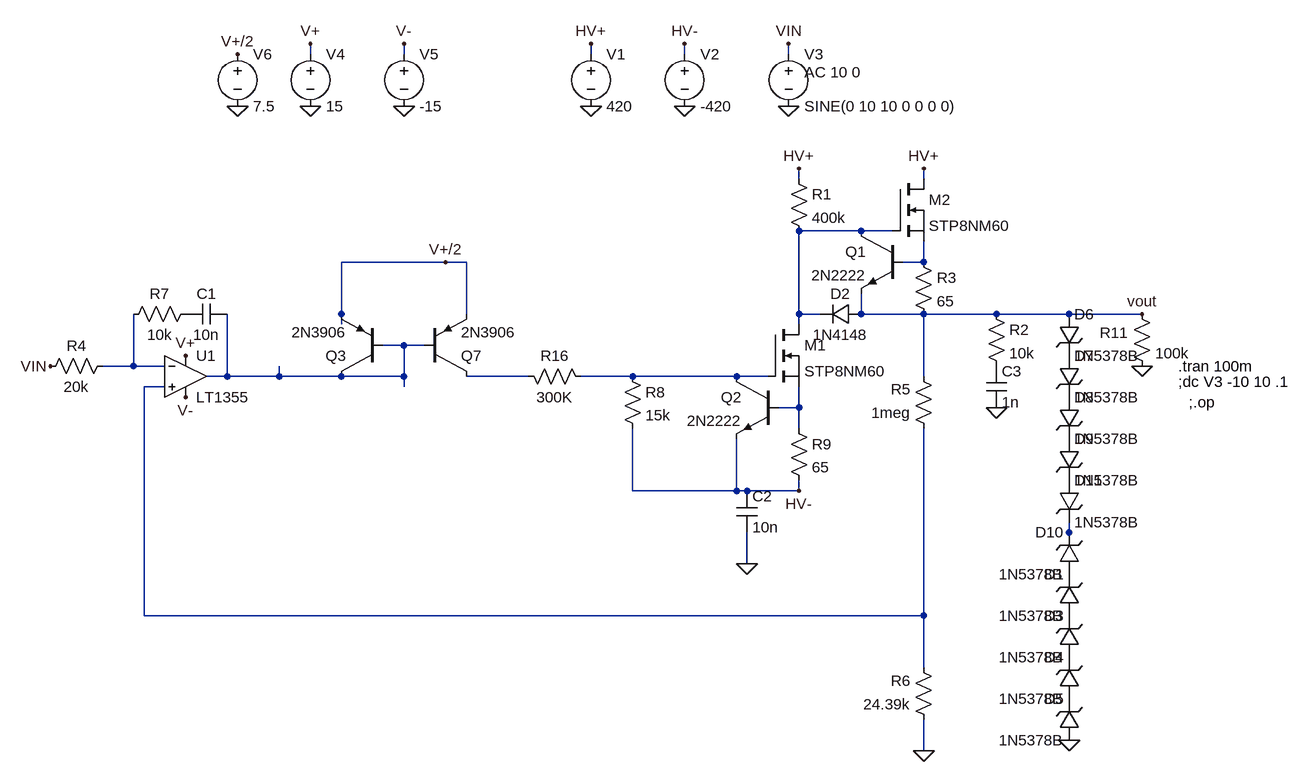
[diagram p0: schematic Draft11b.asc]
Draft11b.asc, the LTspice schematic file:
Version 4
SHEET 1 992 932
WIRE -544 -208 -544 -224
WIRE -400 -208 -400 -224
WIRE -112 -208 -112 -224
WIRE 32 -208 32 -224
WIRE 192 -208 192 -224
WIRE 208 -16 208 -32
WIRE 400 -16 400 -32
WIRE 304 64 208 64
WIRE 352 64 304 64
WIRE -336 112 -496 112
WIRE -304 112 -336 112
WIRE 400 112 400 80
WIRE 400 112 368 112
WIRE -496 192 -496 112
WIRE -304 192 -304 112
WIRE 208 192 208 64
WIRE 240 192 208 192
WIRE 304 192 304 160
WIRE 400 192 304 192
WIRE 512 192 400 192
WIRE 624 192 512 192
WIRE 736 192 624 192
WIRE -496 208 -496 192
WIRE 208 208 208 192
WIRE -400 240 -432 240
WIRE -368 240 -400 240
WIRE -816 272 -816 192
WIRE -816 272 -864 272
WIRE -768 272 -816 272
WIRE -672 288 -672 192
WIRE -672 288 -704 288
WIRE -592 288 -592 272
WIRE -592 288 -672 288
WIRE -496 288 -592 288
WIRE -400 288 -400 240
WIRE -400 288 -496 288
WIRE -208 288 -304 288
WIRE -48 288 -128 288
WIRE 112 288 -48 288
WIRE 160 288 112 288
WIRE 400 288 400 192
WIRE -768 304 -800 304
WIRE -400 304 -400 288
WIRE 208 336 208 304
WIRE 208 336 176 336
WIRE 208 368 208 336
WIRE -48 464 -48 368
WIRE 112 464 112 384
WIRE 112 464 -48 464
WIRE 128 464 112 464
WIRE 208 464 208 448
WIRE 208 464 128 464
WIRE 624 528 624 512
WIRE 624 544 624 528
WIRE 128 576 128 528
WIRE -800 656 -800 304
WIRE 400 656 400 368
WIRE 400 656 -800 656
WIRE 400 736 400 656
WIRE 400 864 400 816
FLAG -112 -128 0
FLAG 32 -128 0
FLAG 192 -128 0
FLAG -112 -224 HV+
FLAG 32 -224 HV-
FLAG 192 -224 VIN
FLAG 208 -32 HV+
FLAG 400 -32 HV+
FLAG -544 -128 0
FLAG -400 -128 0
FLAG -544 -224 V+
FLAG -400 -224 V-
FLAG -736 256 V+
FLAG -736 320 V-
FLAG -944 272 VIN
FLAG 400 864 0
FLAG 128 576 0
FLAG 208 464 HV-
FLAG 512 336 0
FLAG 736 192 vout
FLAG 736 272 0
FLAG 624 848 0
FLAG -656 -128 0
FLAG -656 -208 V+/2
FLAG -336 112 V+/2
SYMBOL nmos 160 208 R0
SYMATTR InstName M1
SYMATTR Value STP8NM60
SYMBOL voltage -112 -224 R0
WINDOW 123 0 0 Left 2
WINDOW 39 0 0 Left 2
SYMATTR InstName V1
SYMATTR Value 420
SYMBOL voltage 32 -224 R0
WINDOW 123 0 0 Left 2
WINDOW 39 0 0 Left 2
SYMATTR InstName V2
SYMATTR Value -420
SYMBOL voltage 192 -224 R0
WINDOW 123 24 44 Left 2
WINDOW 39 0 0 Left 2
SYMATTR Value2 AC 10 0
SYMATTR InstName V3
SYMATTR Value SINE(0 10 10 0 0 0 0)
SYMBOL nmos 352 -16 R0
SYMATTR InstName M2
SYMATTR Value STP8NM60
SYMBOL diode 304 176 R90
WINDOW 0 0 32 VBottom 2
WINDOW 3 32 32 VTop 2
SYMATTR InstName D2
SYMATTR Value 1N4148
SYMBOL npn 368 64 M0
SYMATTR InstName Q1
SYMATTR Value 2N2222
SYMBOL res 384 96 R0
SYMATTR InstName R3
SYMATTR Value 65
SYMBOL voltage -544 -224 R0
WINDOW 123 0 0 Left 2
WINDOW 39 0 0 Left 2
SYMATTR InstName V4
SYMATTR Value 15
SYMBOL voltage -400 -224 R0
WINDOW 123 0 0 Left 2
WINDOW 39 0 0 Left 2
SYMATTR InstName V5
SYMATTR Value -15
SYMBOL Opamps\\LT1355 -736 224 R0
SYMATTR InstName U1
SYMBOL res -848 256 R90
WINDOW 0 0 56 VBottom 2
WINDOW 3 32 56 VTop 2
SYMATTR InstName R4
SYMATTR Value 20k
SYMBOL res 416 384 R180
WINDOW 0 36 76 Left 2
WINDOW 3 36 40 Left 2
SYMATTR InstName R5
SYMATTR Value 1meg
SYMBOL res 416 832 R180
WINDOW 0 36 76 Left 2
WINDOW 3 36 40 Left 2
SYMATTR InstName R6
SYMATTR Value 24.39k
SYMBOL res -720 176 R90
WINDOW 0 0 56 VBottom 2
WINDOW 3 32 56 VTop 2
SYMATTR InstName R7
SYMATTR Value 10k
SYMBOL cap -672 176 R90
WINDOW 0 0 32 VBottom 2
WINDOW 3 32 32 VTop 2
SYMATTR InstName C1
SYMATTR Value 10n
SYMBOL res -64 272 R0
SYMATTR InstName R8
SYMATTR Value 15k
SYMBOL cap 112 464 R0
SYMATTR InstName C2
SYMATTR Value 10n
SYMBOL res 192 -32 R0
SYMATTR InstName R1
SYMATTR Value 400k
SYMBOL res 496 176 R0
SYMATTR InstName R2
SYMATTR Value 10k
SYMBOL cap 496 272 R0
SYMATTR InstName C3
SYMATTR Value 1n
SYMBOL npn 176 288 M0
SYMATTR InstName Q2
SYMATTR Value 2N2222
SYMBOL res 192 352 R0
SYMATTR InstName R9
SYMATTR Value 65
SYMBOL res 720 176 R0
WINDOW 0 -49 45 Left 2
SYMATTR InstName R11
SYMATTR Value 100k
SYMBOL zener 608 192 R0
SYMATTR InstName D6
SYMATTR Value 1N5378B
SYMATTR Description Diode
SYMATTR Type diode
SYMBOL zener 608 256 R0
SYMATTR InstName D7
SYMATTR Value 1N5378B
SYMATTR Description Diode
SYMATTR Type diode
SYMBOL zener 608 320 R0
SYMATTR InstName D8
SYMATTR Value 1N5378B
SYMATTR Description Diode
SYMATTR Type diode
SYMBOL zener 608 384 R0
SYMATTR InstName D9
SYMATTR Value 1N5378B
SYMATTR Description Diode
SYMATTR Type diode
SYMBOL zener 640 656 R180
WINDOW 0 24 64 Left 2
WINDOW 3 24 0 Left 2
SYMATTR InstName D1
SYMATTR Value 1N5378B
SYMATTR Description Diode
SYMATTR Type diode
SYMBOL zener 640 720 R180
WINDOW 0 24 64 Left 2
WINDOW 3 24 0 Left 2
SYMATTR InstName D3
SYMATTR Value 1N5378B
SYMATTR Description Diode
SYMATTR Type diode
SYMBOL zener 640 784 R180
WINDOW 0 24 64 Left 2
WINDOW 3 24 0 Left 2
SYMATTR InstName D4
SYMATTR Value 1N5378B
SYMATTR Description Diode
SYMATTR Type diode
SYMBOL zener 640 848 R180
WINDOW 0 24 64 Left 2
WINDOW 3 24 0 Left 2
SYMATTR InstName D5
SYMATTR Value 1N5378B
SYMATTR Description Diode
SYMATTR Type diode
SYMBOL zener 640 592 R180
WINDOW 0 24 64 Left 2
WINDOW 3 24 0 Left 2
SYMATTR InstName D10
SYMATTR Value 1N5378B
SYMATTR Description Diode
SYMATTR Type diode
SYMBOL zener 608 448 R0
SYMATTR InstName D11
SYMATTR Value 1N5378B
SYMATTR Description Diode
SYMATTR Type diode
SYMBOL pnp -432 288 R180
SYMATTR InstName Q3
SYMATTR Value 2N3906
SYMBOL pnp -368 288 M180
SYMATTR InstName Q7
SYMATTR Value 2N3906
SYMBOL res -224 272 M90
WINDOW 0 0 56 VBottom 2
WINDOW 3 32 56 VTop 2
SYMATTR InstName R16
SYMATTR Value 300K
SYMBOL voltage -656 -224 R0
WINDOW 123 0 0 Left 2
WINDOW 39 0 0 Left 2
SYMATTR InstName V6
SYMATTR Value 7.5
TEXT 792 296 Left 2 !;dc V3 -10 10 .1
TEXT 792 272 Left 2 !.tran 100m
TEXT 808 328 Left 2 !;.op

The netlist it stands for:
* Draft11b.asc
M1 N001 N006 N008 N008 STP8NM60
V1 HV+ 0 420
V2 HV- 0 -420
V3 VIN 0 SINE(0 10 10 0 0 0 0) AC 10 0
M2 HV+ N001 N002 N002 STP8NM60
D2 vout N001 1N4148
Q1 N001 N002 vout 0 2N2222
R3 N002 vout 65
V4 V+ 0 15
V5 V- 0 -15
XU1 N007 N004 V+ V- N003 LT1355  ; pins In+ In- V+ V- OUT
R4 N004 VIN 20k
R5 N007 vout 1meg
R6 0 N007 24.39k
R7 P001 N004 10k
C1 N003 P001 10n
R8 N006 HV- 15k
C2 HV- 0 10n
R1 HV+ N001 400k
R2 vout P002 10k
C3 P002 0 1n
Q2 N006 N008 HV- 0 2N2222
R9 N008 HV- 65
R11 vout 0 100k
D6 vout P003 1N5378B
D7 P003 P004 1N5378B
D8 P004 P005 1N5378B
D9 P005 P006 1N5378B
D1 P007 P008 1N5378B
D3 P009 P007 1N5378B
D4 P010 P009 1N5378B
D5 0 P010 1N5378B
D10 P008 N009 1N5378B
D11 P006 N009 1N5378B
Q3 N003 N003 V+/2 0 2N3906
Q7 N005 N003 V+/2 0 2N3906
R16 N005 N006 300K
V6 V+/2 0 7.5
.model D D
.lib standard.dio
.model NPN NPN
.model PNP PNP
.lib standard.bjt
.model NMOS NMOS
.model PMOS PMOS
.lib standard.mos
;dc V3 -10 10 .1
.tran 100m
;.op
.backanno
.end